# EAGLE schematic L4V2-5 (EAGLE 8.7.0)

## Sheet 1 of 3: MCUs
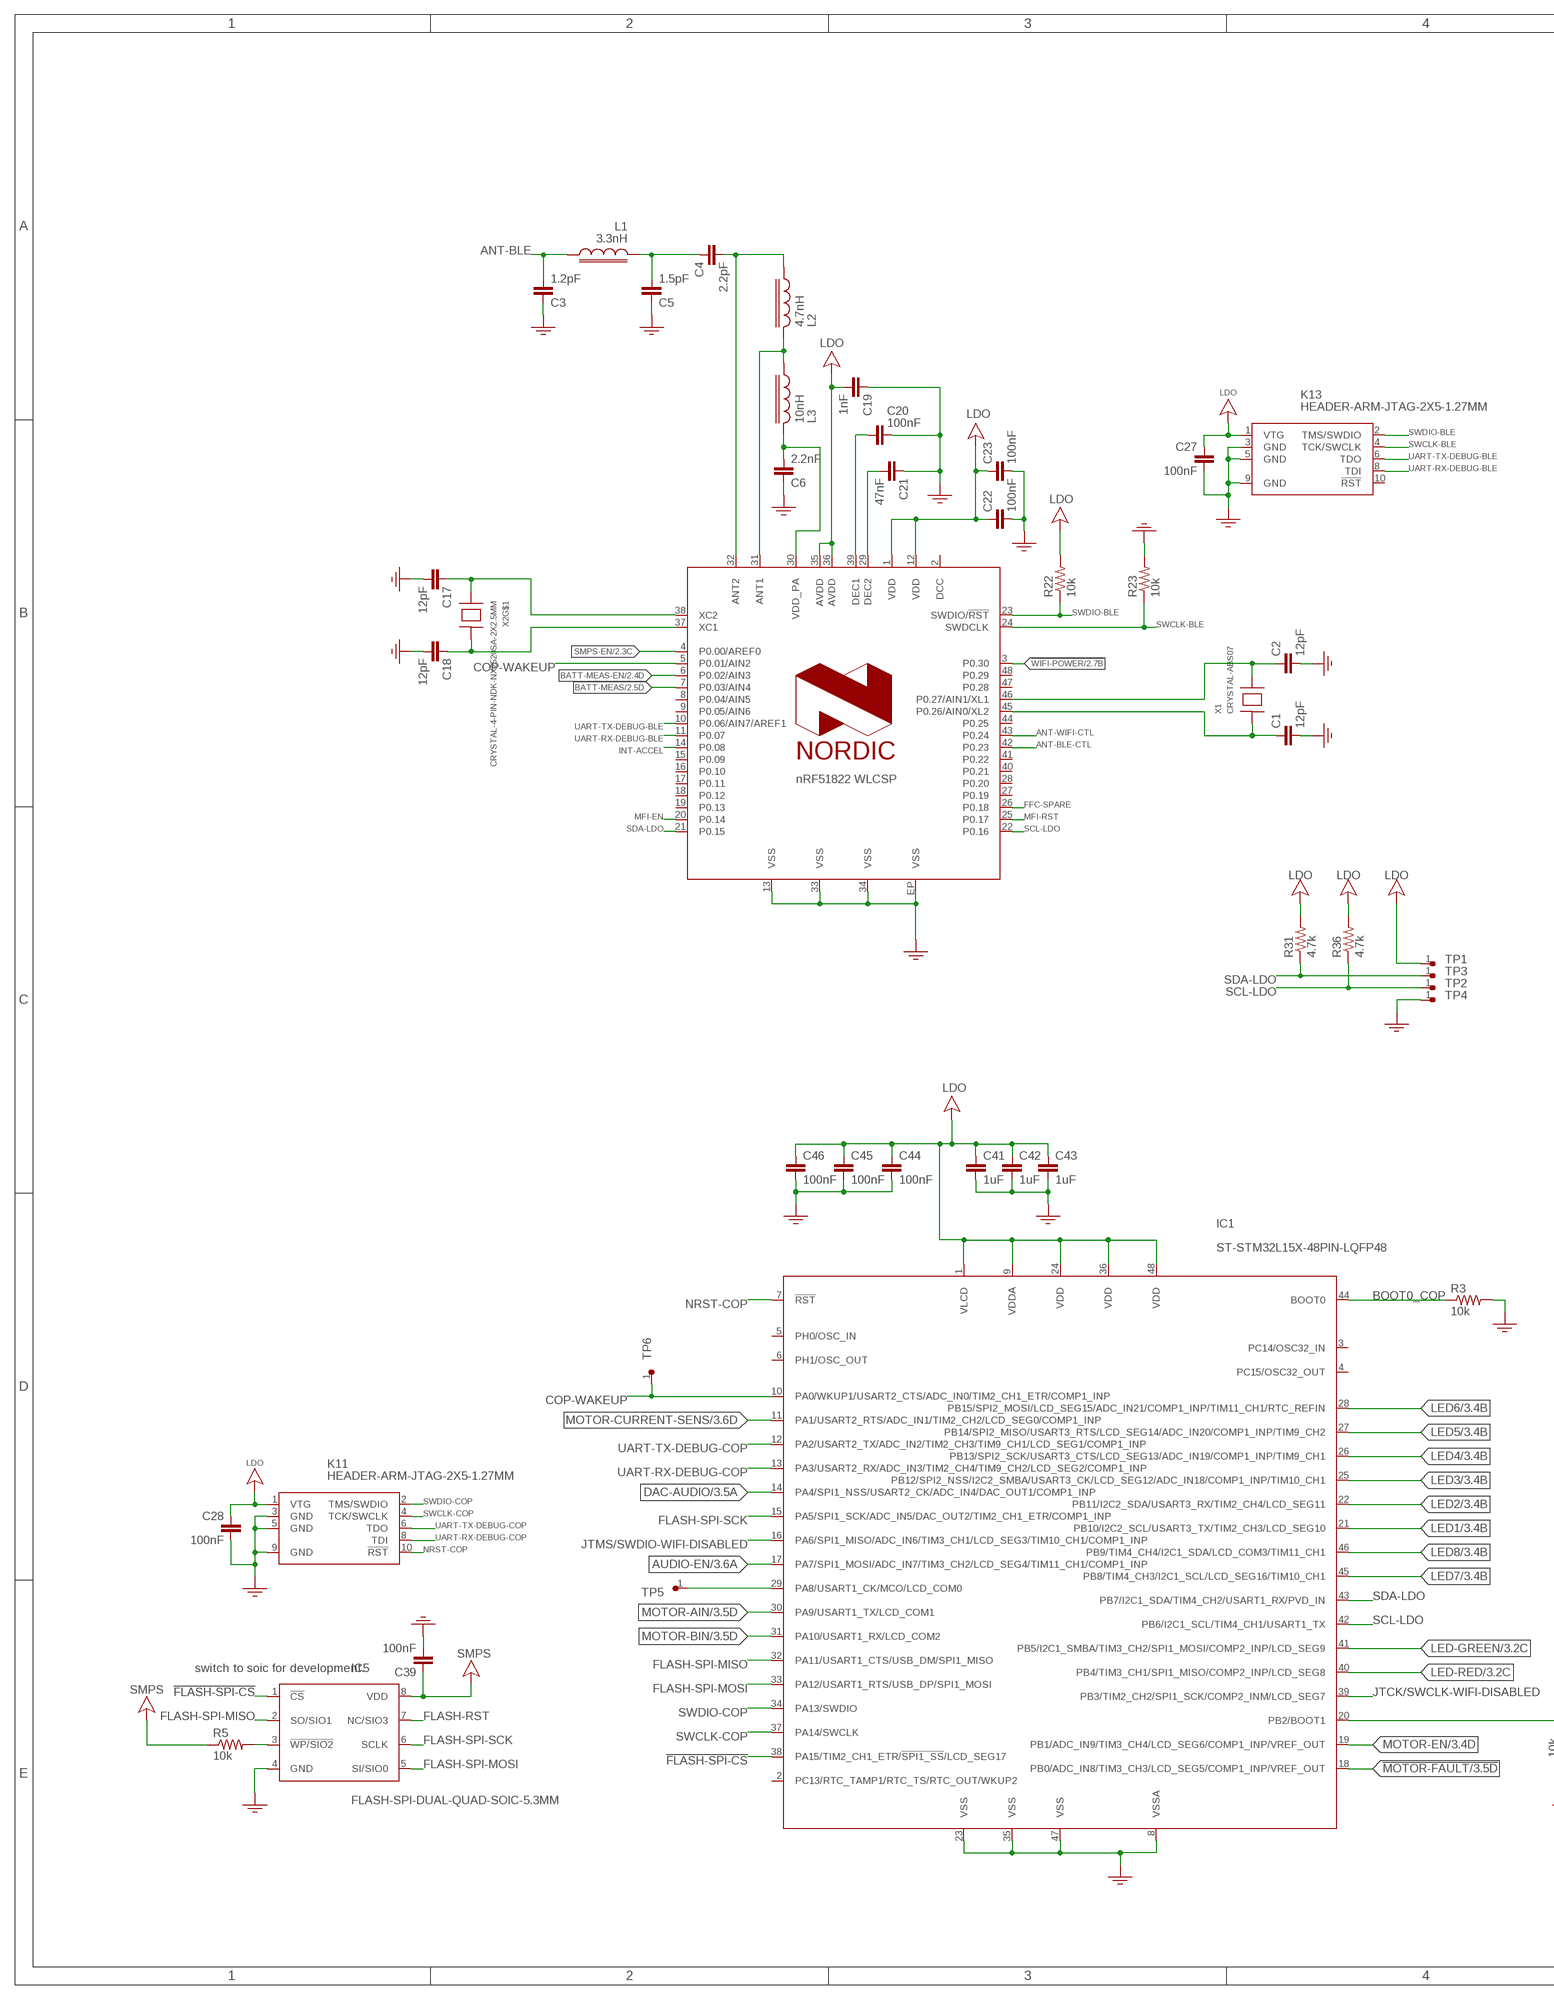
[diagram p0: schematic, sheet 1, part 1 of 2]
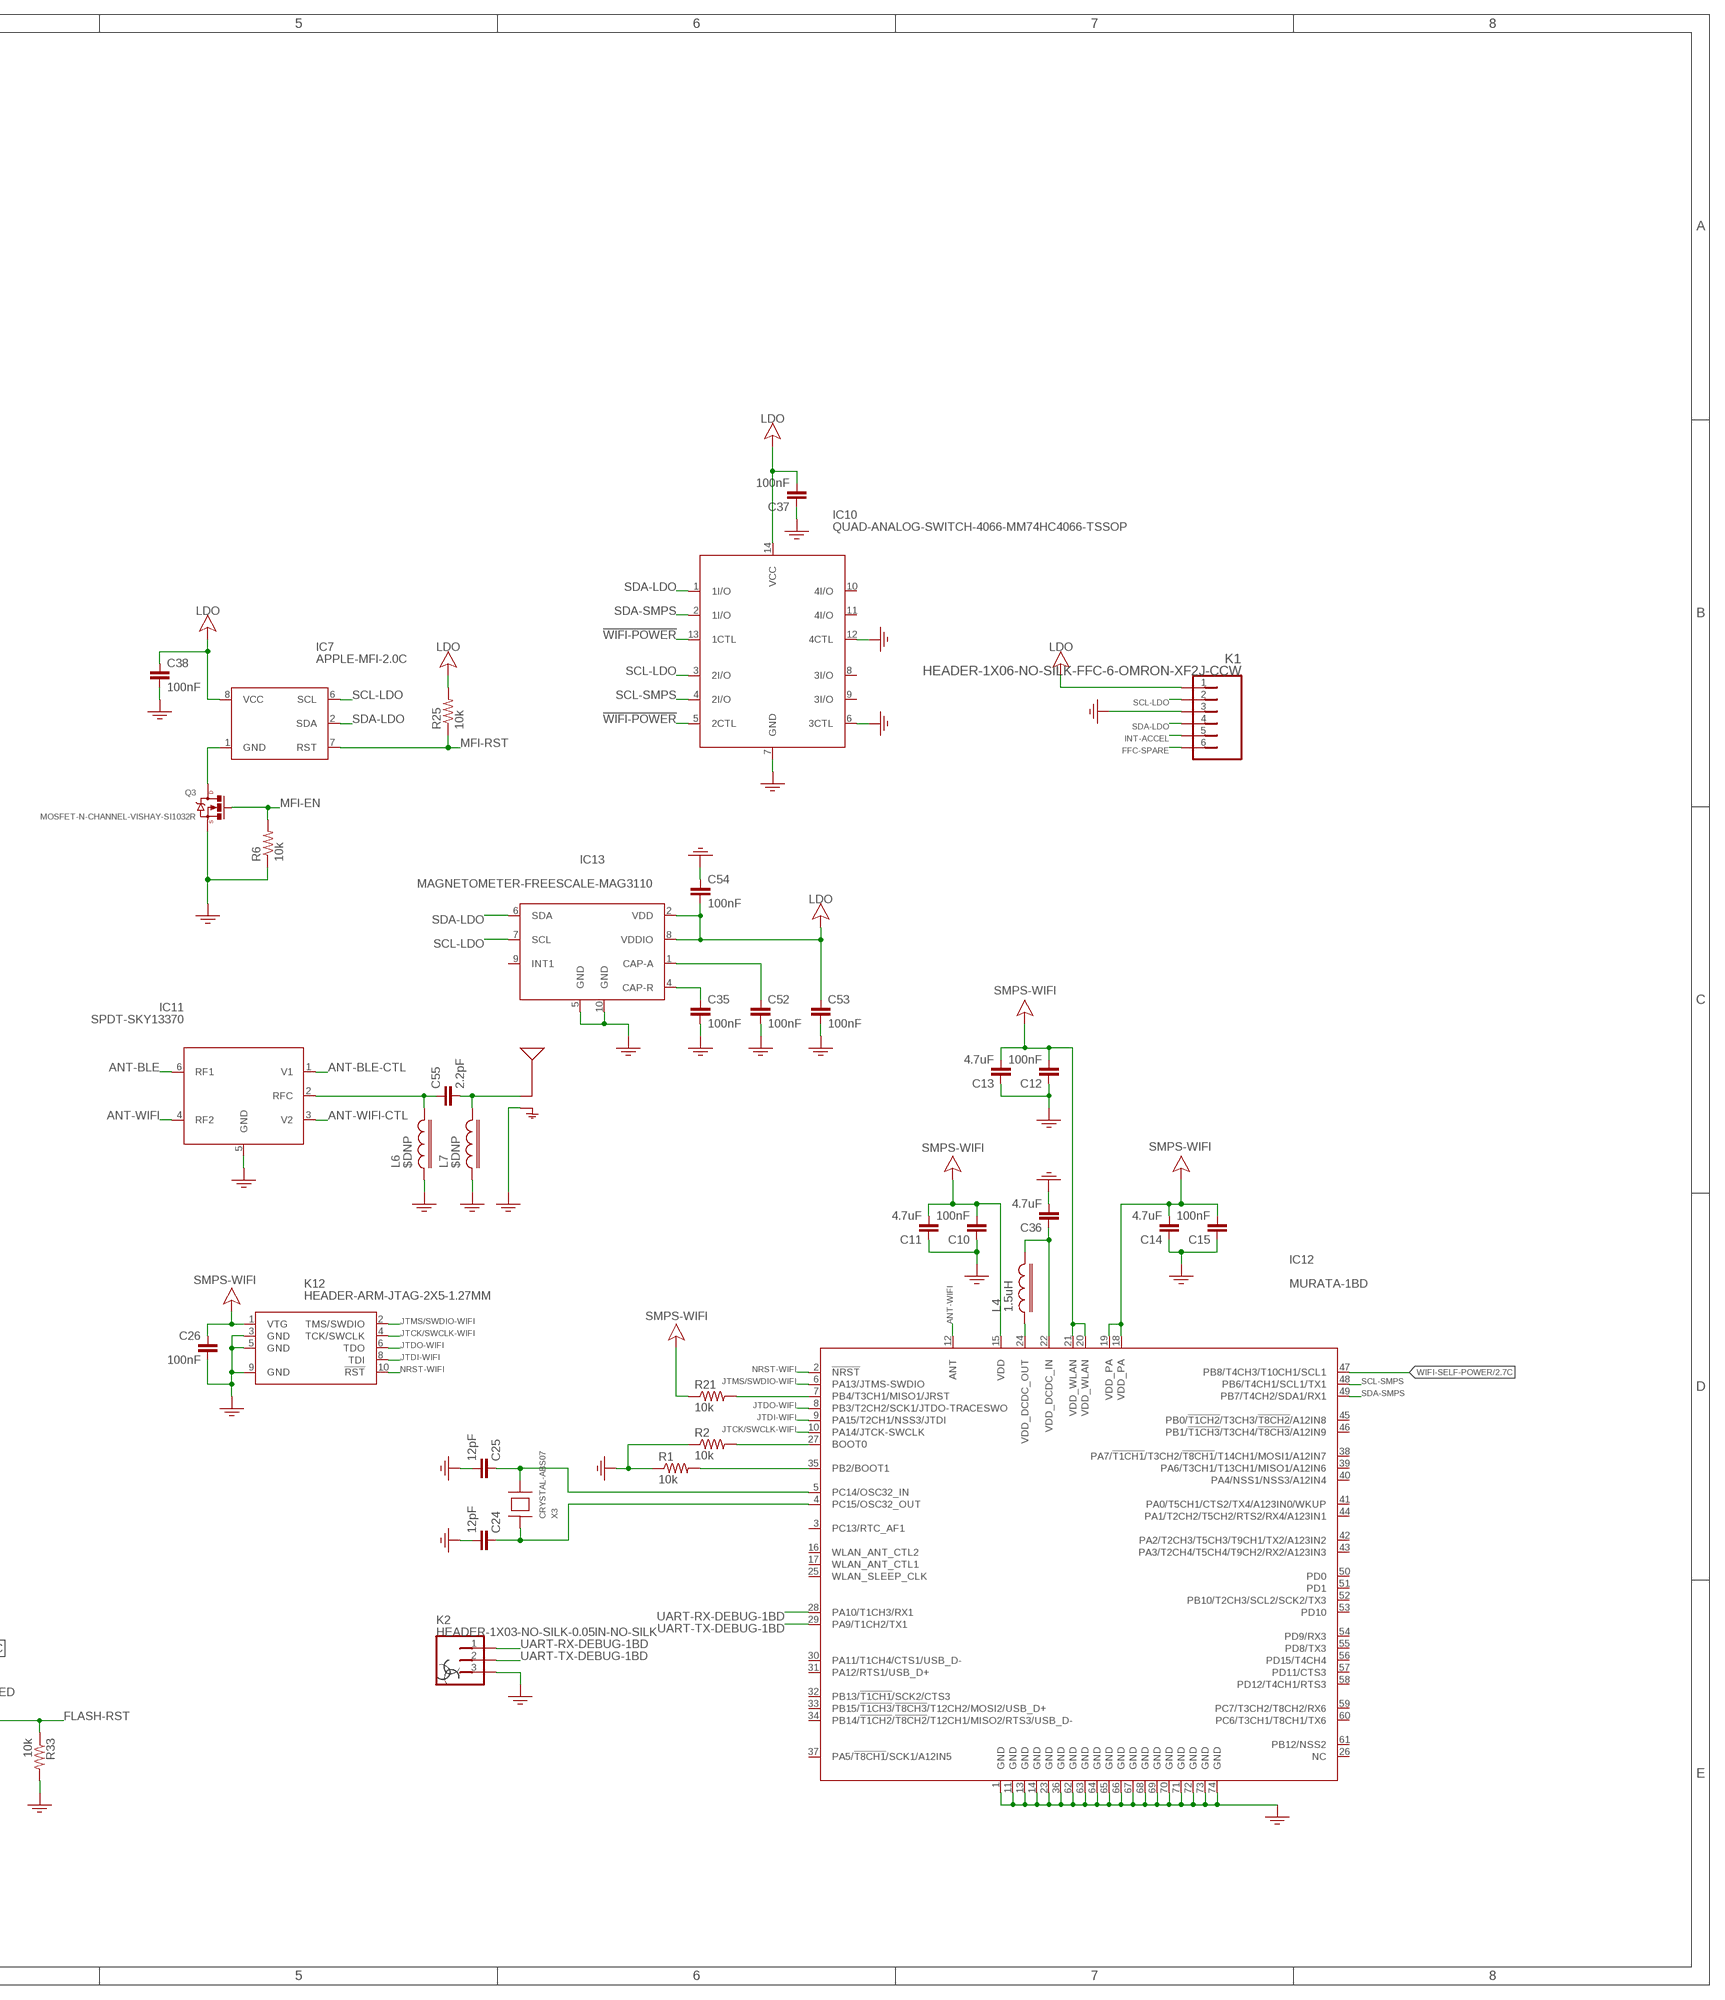
[diagram p1: schematic, sheet 1, part 2 of 2]

### Parts
ANT1  ANTENNA-WITH-GND-2.450GHZ-TI-AN043  [ANTENNA-2.450GHZ-TI-AN043]
C1  12pF  CAP-0402  [0402]
C2  12pF  CAP-0402  [0402]
C3  1.2pF  CAP-0402  [0402]
C4  2.2pF  CAP-0402  [0402]
C5  1.5pF  CAP-0402  [0402]
C6  2.2nF  CAP-0402  [0402]
C10  100nF  CAP-0402  [0402]
C11  4.7uF  CAP-0402  [0402]
C12  100nF  CAP-0402  [0402]
C13  4.7uF  CAP-0402  [0402]
C14  4.7uF  CAP-0402  [0402]
C15  100nF  CAP-0402  [0402]
C17  12pF  CAP-0402  [0402]
C18  12pF  CAP-0402  [0402]
C19  1nF  CAP-0402  [0402]
C20  100nF  CAP-0402  [0402]
C21  47nF  CAP-0402  [0402]
C22  100nF  CAP-0402  [0402]
C23  100nF  CAP-0402  [0402]
C24  12pF  CAP-0402  [0402]
C25  12pF  CAP-0402  [0402]
C26  100nF  CAP-0402  [0402]
C27  100nF  CAP-0402  [0402]
C28  100nF  CAP-0402  [0402]
C35  100nF  CAP-0402  [0402]
C36  4.7uF  CAP-0402  [0402]
C37  100nF  CAP-0402  [0402]
C38  100nF  CAP-0402  [0402]
C39  100nF  CAP-0402  [0402]
C41  1uF  CAP-0402  [0402]
C42  1uF  CAP-0402  [0402]
C43  1uF  CAP-0402  [0402]
C44  100nF  CAP-0402  [0402]
C45  100nF  CAP-0402  [0402]
C46  100nF  CAP-0402  [0402]
C52  100nF  CAP-0402  [0402]
C53  100nF  CAP-0402  [0402]
C54  100nF  CAP-0402  [0402]
C55  2.2pF  CAP-0402-MIN  [0402-MIN]
IC1  ST-STM32L15X-48PIN-LQFP48  [LQFP48-0.5MM]
IC3  BLUETOOTH-4.0-SOC-NORDIC-NRF51822-QFN48  [QFN48-5X5MM-0.4MM]
IC5  FLASH-SPI-DUAL-QUAD-SOIC-5.3MM  [SOIC8-5.3MM-MINIMAL]
IC7  APPLE-MFI-2.0C  [DFN8-2.5MMX2.5MM]
IC10  QUAD-ANALOG-SWITCH-4066-MM74HC4066-TSSOP  [TSSOP14]
IC11  SPDT-SKY13370  [DFN6-1.5MMX1.5MM]
IC12  MURATA-1BD  [MURATA-1BD]
IC13  MAGNETOMETER-FREESCALE-MAG3110  [QFN10-2X2MM-FREESCALE-MAG3110]
K1  HEADER-1X06-NO-SILK-FFC-6-OMRON-XF2J-CCW  [HEADER-FFC-6-OMRON-XF2J-CCW]
K2  HEADER-1X03-NO-SILK-0.05IN-NO-SILK  [HEADER-1X03-0.05IN-NO-SILK]
K11  HEADER-ARM-JTAG-2X5-1.27MM  [HEADER-SMT-1.27MM-5X2-JTAG]
K12  HEADER-ARM-JTAG-2X5-1.27MM  [HEADER-SMT-1.27MM-5X2-JTAG]
K13  HEADER-ARM-JTAG-2X5-1.27MM  [HEADER-SMT-1.27MM-5X2-JTAG]
L1  3.3nH  INDUCTOR-0402  [0402]
L2  4.7nH  INDUCTOR-0402  [0402]
L3  10nH  INDUCTOR-0402  [0402]
L4  1.5uH  INDUCTOR-0805-WIDE  [0805-WIDE]
L6  $DNP  INDUCTOR-0402-MIN  [0402-MIN]
L7  $DNP  INDUCTOR-0402-MIN  [0402-MIN]
Q3  MOSFET-N-CHANNEL-VISHAY-SI1032R  [SC-75A]
R1  10k  RESISTOR-0402  [0402]
R2  10k  RESISTOR-0402  [0402]
R3  10k  RESISTOR-0402  [0402]
R5  10k  RESISTOR-0402  [0402]
R6  10k  RESISTOR-0402  [0402]
R21  10k  RESISTOR-0402  [0402]
R22  10k  RESISTOR-0402  [0402]
R23  10k  RESISTOR-0402  [0402]
R25  10k  RESISTOR-0402  [0402]
R31  4.7k  RESISTOR-0402  [0402]
R33  10k  RESISTOR-0402  [0402]
R36  4.7k  RESISTOR-0402  [0402]
TP1  $DNP  TEST-POINT-0.75MM  [TEST-POINT-0.75MM]
TP2  $DNP  TEST-POINT-0.75MM  [TEST-POINT-0.75MM]
TP3  $DNP  TEST-POINT-0.75MM  [TEST-POINT-0.75MM]
TP4  $DNP  TEST-POINT-0.75MM  [TEST-POINT-0.75MM]
TP5  $DNP  TEST-POINT-0.75MM  [TEST-POINT-0.75MM]
TP6  $DNP  TEST-POINT-0.75MM  [TEST-POINT-0.75MM]
X1  CRYSTAL-ABS07  CRYSTAL-1206  [1206-MIN]
X2  CRYSTAL-4-PIN-NDK-NX2520SA-2X2.5MM  [CRYSTAL-NDK-NX2025SA-2X2.5MM]
X3  CRYSTAL-ABS07  CRYSTAL-1206  [1206-MIN]

### Nets
16MHZ-XTAL-IN: C18.2 IC3.37(XC1) X2.1
16MHZ-XTAL-OUT: C17.2 IC3.38(XC2) X2.3
32KHZ-XTAL-IN-BLE: C2.2 IC3.46(P0.27/AIN1/XL1) X1.2
32KHZ-XTAL-IN-WIFI: C25.2 IC12.5(PC14/OSC32_IN) X3.2
32KHZ-XTAL-OUT-BLE: C1.2 IC3.45(P0.26/AIN0/XL2) X1.1
32KHZ-XTAL-OUT-WIFI: C24.2 IC12.4(PC15/OSC32_OUT) X3.1
!FLASH-SPI-CS: IC1.38(PA15/TIM2_CH1_ETR/!SPI1_SS!/LCD_SEG17) IC5.1(!CS)
!MOTOR-FAULT: IC1.18(PB0/ADC_IN8/TIM3_CH3/LCD_SEG5/COMP1_INP/VREF_OUT) ; also sheet 3
!WIFI-POWER: IC3.3(P0.30) IC10.5(2CTL) IC10.13(1CTL) ; also sheet 2
ANT-BLE: C3.1 IC11.6(RF1) L1.2
ANT-BLE-CTL: IC3.42(P0.23) IC11.1(V1)
ANT-WIFI: IC11.4(RF2) IC12.12(ANT)
ANT-WIFI-CTL: IC3.43(P0.24) IC11.3(V2)
AUDIO-EN: IC1.17(PA7/SPI1_MOSI/ADC_IN7/TIM3_CH2/LCD_SEG4/TIM11_CH1/COMP1_INP) ; also sheet 3
BATT-MEAS: IC3.7(P0.03/AIN4) ; also sheet 2
BATT-MEAS-EN: IC3.6(P0.02/AIN3) ; also sheet 2
BOOT0_COP: IC1.44(BOOT0) R3.1
COP-WAKEUP: IC1.10(PA0/WKUP1/USART2_CTS/ADC_IN0/TIM2_CH1_ETR/COMP1_INP) IC3.5(P0.01/AIN2) TP6.1
DAC-AUDIO: IC1.14(PA4/SPI1_NSS/USART2_CK/ADC_IN4/DAC_OUT1/COMP1_INP) ; also sheet 3
FFC-SPARE: IC3.26(P0.18) K1.6
FLASH-RST: IC1.20(PB2/BOOT1) IC5.7(NC/SIO3) R33.1
FLASH-SPI-MISO: IC1.32(PA11/USART1_CTS/USB_DM/SPI1_MISO) IC5.2(SO/SIO1)
FLASH-SPI-MOSI: IC1.33(PA12/USART1_RTS/USB_DP/SPI1_MOSI) IC5.5(SI/SIO0)
FLASH-SPI-SCK: IC1.15(PA5/SPI1_SCK/ADC_IN5/DAC_OUT2/TIM2_CH1_ETR/COMP1_INP) IC5.6(SCLK)
GND: ANT1.RFGND(GND) C1.1 C2.1 C3.2 C5.2 C6.2 C10.2 C11.2 C12.2 C13.2 C14.2 C15.2 C17.1 C18.1 C19.2 C20.2 C21.2 C22.1 C23.1 C24.1 C25.1 C26.1 C27.1 C28.1 C35.1 C36.1 C37.2 C38.1 C39.1 C41.1 C42.1 C43.1 C44.1 C45.1 C46.1 C52.1 C53.1 C54.2 IC1.8(VSSA) IC1.23(VSS) IC1.35(VSS) IC1.47(VSS) IC3.13(VSS) IC3.33(VSS) IC3.34(VSS) IC3.EP(VSS) IC5.4(GND) IC10.6(3CTL) IC10.7(GND) IC10.12(4CTL) IC11.5(GND) IC12.1(GND) IC12.11(GND) IC12.13(GND) IC12.14(GND) IC12.23(GND) IC12.36(GND) IC12.62(GND) IC12.63(GND) IC12.64(GND) IC12.65(GND) IC12.66(GND) IC12.67(GND) IC12.68(GND) IC12.69(GND) IC12.70(GND) IC12.71(GND) IC12.72(GND) IC12.73(GND) IC12.74(GND) IC13.5(GND) IC13.10(GND) K1.3 K2.3 K11.3(GND) K11.5(GND) K11.9(GND) K12.3(GND) K12.5(GND) K12.9(GND) K13.3(GND) K13.5(GND) K13.9(GND) L6.1 L7.1 Q3.2(SOURCE) R1.1 R2.1 R3.2 R6.1 R23.2 R33.2 TP4.1 ; also sheet 2,3
INT-ACCEL: IC3.14(P0.08) K1.5
JRST-WIFI: IC12.7(PB4/T3CH1/MISO1/JRST) R21.2
JTCK/SWCLK-WIFI: IC12.10(PA14/JTCK-SWCLK) K12.4(TCK/SWCLK)
JTCK/SWCLK-WIFI-DISABLED: IC1.39(PB3/TIM2_CH2/SPI1_SCK/COMP2_INM/LCD_SEG7)
JTDI-WIFI: IC12.9(PA15/T2CH1/NSS3/JTDI) K12.8(TDI)
JTDO-WIFI: IC12.8(PB3/T2CH2/SCK1/JTDO-TRACESWO) K12.6(TDO)
JTMS/SWDIO-WIFI: IC12.6(PA13/JTMS-SWDIO) K12.2(TMS/SWDIO)
JTMS/SWDIO-WIFI-DISABLED: IC1.16(PA6/SPI1_MISO/ADC_IN6/TIM3_CH1/LCD_SEG3/TIM10_CH1/COMP1_INP)
LDO: C19.1 C22.2 C23.2 C27.2 C28.2 C37.1 C38.2 C41.2 C42.2 C43.2 C44.2 C45.2 C46.2 C53.2 C54.1 IC1.1(VLCD) IC1.9(VDDA) IC1.24(VDD) IC1.36(VDD) IC1.48(VDD) IC3.1(VDD) IC3.12(VDD) IC3.35(AVDD) IC3.36(AVDD) IC7.8(VCC) IC10.14(VCC) IC13.2(VDD) IC13.8(VDDIO) K1.1 K11.1(VTG) K13.1(VTG) R22.2 R25.2 R31.2 R36.2 TP1.1 ; supply symbol labelled V ; also sheet 2
LED1: IC1.21(PB10/I2C2_SCL/USART3_TX/TIM2_CH3/LCD_SEG10) ; also sheet 3
LED2: IC1.22(PB11/I2C2_SDA/USART3_RX/TIM2_CH4/LCD_SEG11) ; also sheet 3
LED3: IC1.25(PB12/SPI2_NSS/I2C2_SMBA/USART3_CK/LCD_SEG12/ADC_IN18/COMP1_INP/TIM10_CH1) ; also sheet 3
LED4: IC1.26(PB13/SPI2_SCK/USART3_CTS/LCD_SEG13/ADC_IN19/COMP1_INP/TIM9_CH1) ; also sheet 3
LED5: IC1.27(PB14/SPI2_MISO/USART3_RTS/LCD_SEG14/ADC_IN20/COMP1_INP/TIM9_CH2) ; also sheet 3
LED6: IC1.28(PB15/SPI2_MOSI/LCD_SEG15/ADC_IN21/COMP1_INP/TIM11_CH1/RTC_REFIN) ; also sheet 3
LED7: IC1.45(PB8/TIM4_CH3/I2C1_SCL/LCD_SEG16/TIM10_CH1) ; also sheet 3
LED8: IC1.46(PB9/TIM4_CH4/I2C1_SDA/LCD_COM3/TIM11_CH1) ; also sheet 3
LED-GREEN: IC1.41(PB5/I2C1_SMBA/TIM3_CH2/SPI1_MOSI/COMP2_INP/LCD_SEG9) ; also sheet 3
LED-RED: IC1.40(PB4/TIM3_CH1/SPI1_MISO/COMP2_INP/LCD_SEG8) ; also sheet 3
MFI-EN: IC3.20(P0.14) Q3.1(GATE) R6.2
MFI-RST: IC3.25(P0.17) IC7.7(RST) R25.1
MOTOR-AIN: IC1.30(PA9/USART1_TX/LCD_COM1) ; also sheet 3
MOTOR-BIN: IC1.31(PA10/USART1_RX/LCD_COM2) ; also sheet 3
MOTOR-CURRENT-SENS: IC1.11(PA1/USART2_RTS/ADC_IN1/TIM2_CH2/LCD_SEG0/COMP1_INP) ; also sheet 3
MOTOR-EN: IC1.19(PB1/ADC_IN9/TIM3_CH4/LCD_SEG6/COMP1_INP/VREF_OUT) ; also sheet 3
N$1: C20.1 IC3.39(DEC1)
N$2: IC3.31(ANT1) L2.1 L3.2
N$3: C55.2 IC11.2(RFC) L6.2
N$4: C4.1 IC3.32(ANT2) L2.2
N$5: C4.2 C5.1 L1.1
N$8: IC12.27(BOOT0) R2.2
N$9: IC12.24(VDD_DCDC_OUT) L4.1
N$11: C21.1 IC3.29(DEC2)
N$14: IC12.35(PB2/BOOT1) R1.2
N$19: IC5.3(!WP/SIO2) R5.2
N$20: ANT1.ANT(RF) C55.1 L7.2
N$21: IC7.1(GND) Q3.3(DRAIN)
N$24: IC1.29(PA8/USART1_CK/MCO/LCD_COM0) TP5.1
N$44: C6.1 IC3.30(VDD_PA) L3.1
N$50: C36.2 IC12.22(VDD_DCDC_IN) L4.2
N$51: C35.2 IC13.4(CAP-R)
N$52: C52.2 IC13.1(CAP-A)
NRST-COP: IC1.7(!RST) K11.10(!RST)
NRST-WIFI: IC12.2(!NRST) K12.10(!RST)
SCL-LDO: IC1.42(PB6/I2C1_SCL/TIM4_CH1/USART1_TX) IC3.22(P0.16) IC7.6(SCL) IC10.3(2I/O) IC13.7(SCL) K1.2 R36.1 TP2.1
SCL-SMPS: IC10.4(2I/O) IC12.48(PB6/T4CH1/SCL1/TX1)
SDA-LDO: IC1.43(PB7/I2C1_SDA/TIM4_CH2/USART1_RX/PVD_IN) IC3.21(P0.15) IC7.2(SDA) IC10.1(1I/O) IC13.6(SDA) K1.4 R31.1 TP3.1
SDA-SMPS: IC10.2(1I/O) IC12.49(PB7/T4CH2/SDA1/RX1)
SMPS: C39.2 IC5.8(VDD) R5.1 ; supply symbol labelled V ; also sheet 2,3
SMPS-EN: IC3.4(P0.00/AREF0) ; also sheet 2
SMPS-WIFI: C10.1 C11.1 C12.1 C13.1 C14.1 C15.1 C26.2 IC12.15(VDD) IC12.18(VDD_PA) IC12.19(VDD_PA) IC12.20(VDD_WLAN) IC12.21(VDD_WLAN) K12.1(VTG) R21.1 ; supply symbol labelled V ; also sheet 2
SWCLK-BLE: IC3.24(SWDCLK) K13.4(TCK/SWCLK) R23.1
SWCLK-COP: IC1.37(PA14/SWCLK) K11.4(TCK/SWCLK)
SWDIO-BLE: IC3.23(SWDIO/!RST) K13.2(TMS/SWDIO) R22.1
SWDIO-COP: IC1.34(PA13/SWDIO) K11.2(TMS/SWDIO)
UART-RX-DEBUG-1BD: IC12.28(PA10/T1CH3/RX1) K2.1
UART-RX-DEBUG-BLE: IC3.11(P0.07) K13.8(TDI)
UART-RX-DEBUG-COP: IC1.13(PA3/USART2_RX/ADC_IN3/TIM2_CH4/TIM9_CH2/LCD_SEG2/COMP1_INP) K11.8(TDI)
UART-TX-DEBUG-1BD: IC12.29(PA9/T1CH2/TX1) K2.2
UART-TX-DEBUG-BLE: IC3.10(P0.06/AIN7/AREF1) K13.6(TDO)
UART-TX-DEBUG-COP: IC1.12(PA2/USART2_TX/ADC_IN2/TIM2_CH3/TIM9_CH1/LCD_SEG1/COMP1_INP) K11.6(TDO)
WIFI-SELF-POWER: IC12.47(PB8/T4CH3/T10CH1/SCL1) ; also sheet 2
Unconnected: IC1.2(PC13/RTC_TAMP1/RTC_TS/RTC_OUT/WKUP2) IC1.3(PC14/OSC32_IN) IC1.4(PC15/OSC32_OUT) IC1.5(PH0/OSC_IN) IC1.6(PH1/OSC_OUT) IC3.2(DCC) IC3.8(P0.04/AIN5) IC3.9(P0.05/AIN6) IC3.15(P0.09) IC3.16(P0.10) IC3.17(P0.11) IC3.18(P0.12) IC3.19(P0.13) IC3.27(P0.19) IC3.28(P0.20) IC3.40(P0.21) IC3.41(P0.22) IC3.44(P0.25) IC3.47(P0.28) IC3.48(P0.29) IC10.8(3I/O) IC10.9(3I/O) IC10.10(4I/O) IC10.11(4I/O) IC12.3(PC13/RTC_AF1) IC12.16(WLAN_ANT_CTL2) IC12.17(WLAN_ANT_CTL1) IC12.25(WLAN_SLEEP_CLK) IC12.26(NC) IC12.30(PA11/T1CH4/CTS1/USB_D-) IC12.31(PA12/RTS1/USB_D+) IC12.32(PB13/!T1CH1!/SCK2/CTS3) IC12.33(PB15/!T1CH3!/!T8CH3!/T12CH2/MOSI2/USB_D+) IC12.34(PB14/!T1CH2!/!T8CH2!/T12CH1/MISO2/RTS3/USB_D-) IC12.37(PA5/!T8CH1!/SCK1/A12IN5) IC12.38(PA7/!T1CH1!/T3CH2/!T8CH1!/T14CH1/MOSI1/A12IN7) IC12.39(PA6/T3CH1/T13CH1/MISO1/A12IN6) IC12.40(PA4/NSS1/NSS3/A12IN4) IC12.41(PA0/T5CH1/CTS2/TX4/A123IN0/WKUP) IC12.42(PA2/T2CH3/T5CH3/T9CH1/TX2/A123IN2) IC12.43(PA3/T2CH4/T5CH4/T9CH2/RX2/A123IN3) IC12.44(PA1/T2CH2/T5CH2/RTS2/RX4/A123IN1) IC12.45(PB0/!T1CH2!/T3CH3/!T8CH2!/A12IN8) IC12.46(PB1/!T1CH3!/T3CH4/!T8CH3!/A12IN9) IC12.50(PD0) IC12.51(PD1) IC12.52(PB10/T2CH3/SCL2/SCK2/TX3) IC12.53(PD10) IC12.54(PD9/RX3) IC12.55(PD8/TX3) IC12.56(PD15/T4CH4) IC12.57(PD11/CTS3) IC12.58(PD12/T4CH1/RTS3) IC12.59(PC7/T3CH2/T8CH2/RX6) IC12.60(PC6/T3CH1/T8CH1/TX6) IC12.61(PB12/NSS2) IC13.9(INT1) K13.10(!RST) X2.2 X2.4

### Notes on the sheet
- switch to soic for development.

## Sheet 2 of 3: Power
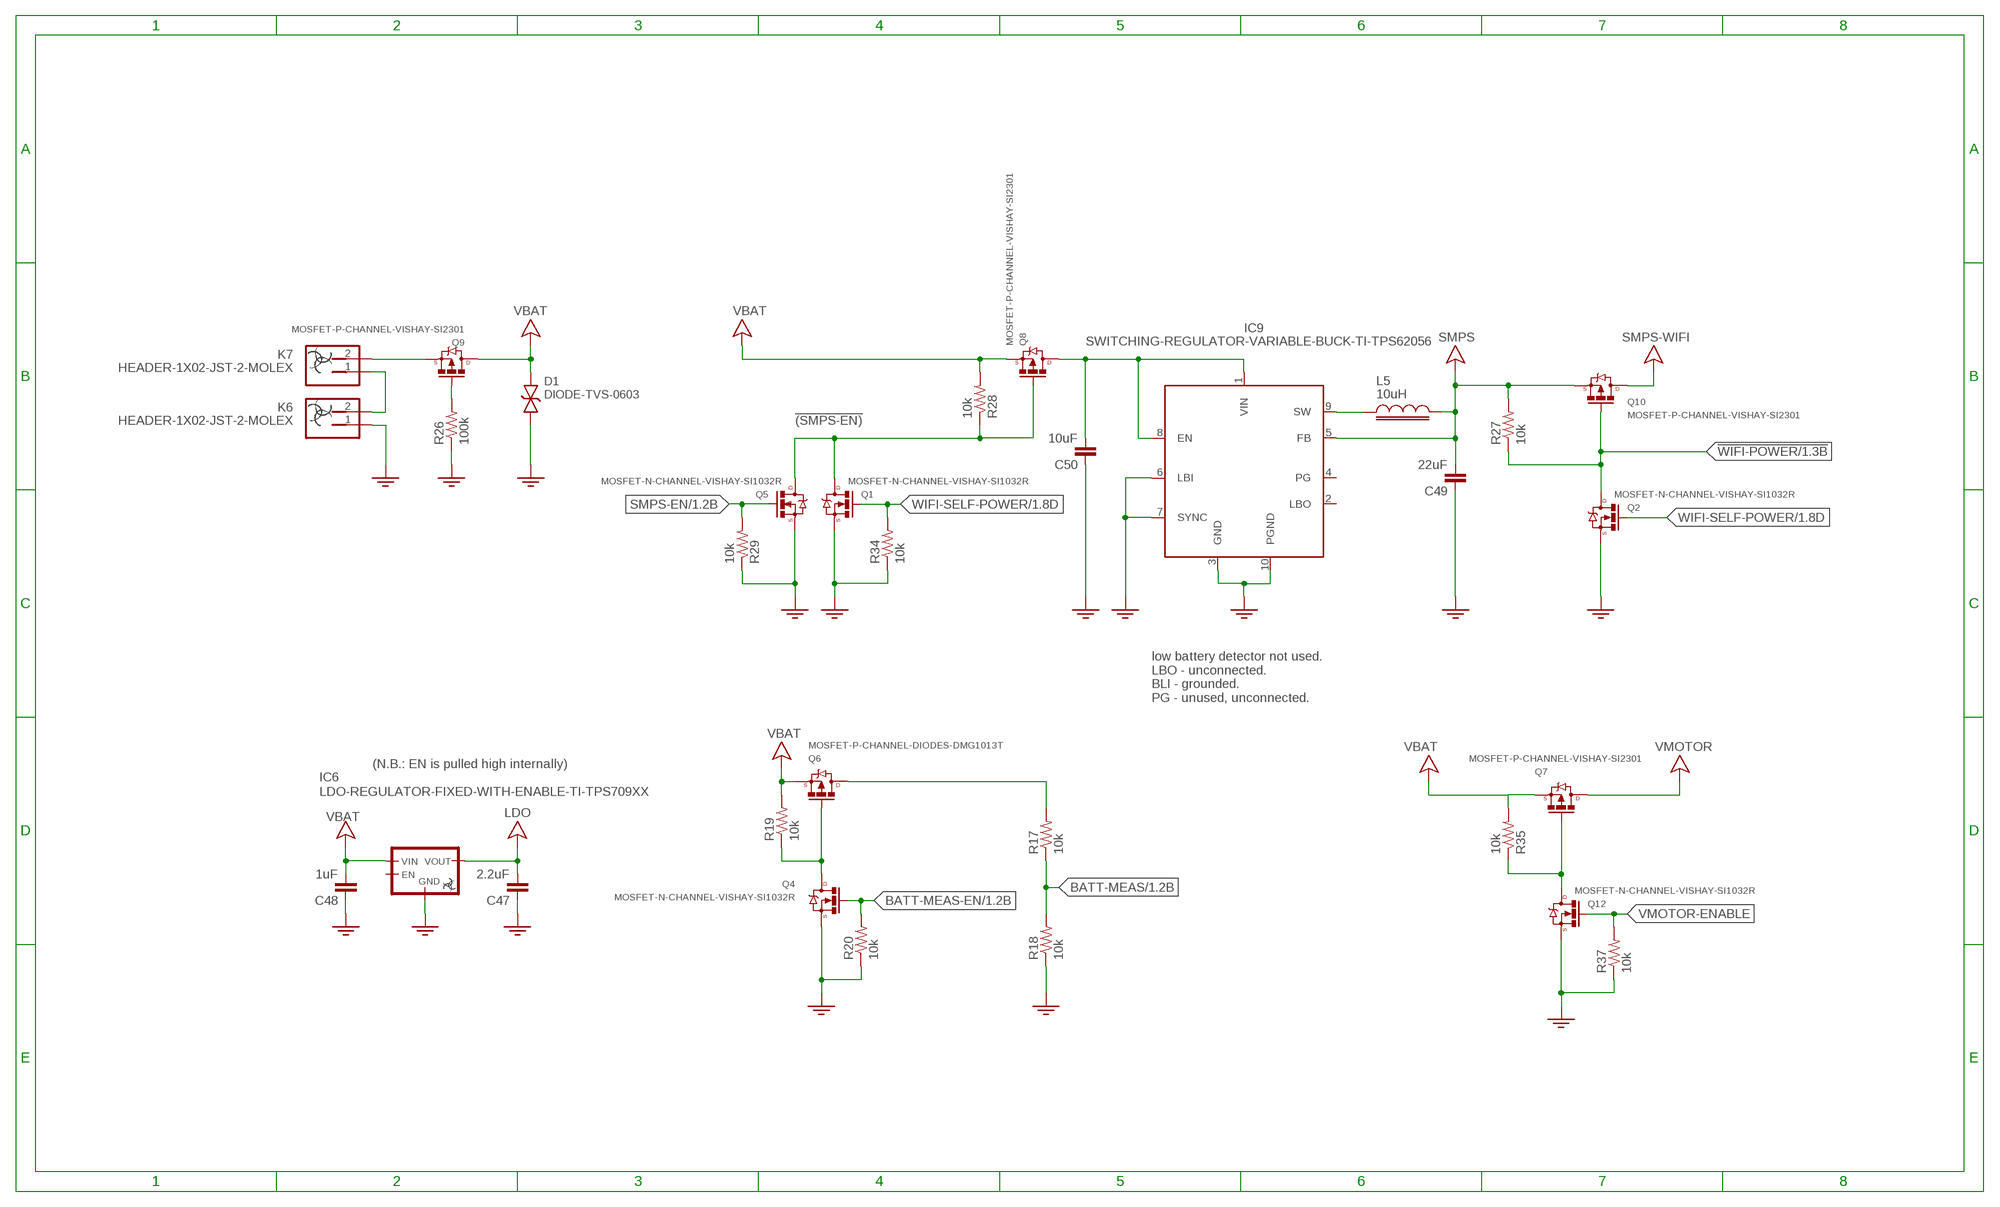
[diagram p2: schematic, sheet 2]

### Parts
C47  2.2uF  CAP-0402  [0402]
C48  1uF  CAP-0402  [0402]
C49  22uF  CAP-0805-MIN  [0805-MIN]
C50  10uF  CAP-0805-MIN  [0805-MIN]
D1  DIODE-TVS-0603  [0603]
IC6  LDO-REGULATOR-FIXED-WITH-ENABLE-TI-TPS709XX  [SOT23-5]
IC9  SWITCHING-REGULATOR-VARIABLE-BUCK-TI-TPS62056  [VSSOP10]
K6  HEADER-1X02-JST-2-MOLEX  [HEADER-JST-2-MOLEX-53261-0271]
K7  HEADER-1X02-JST-2-MOLEX  [HEADER-JST-2-MOLEX-53261-0271]
L5  10uH  INDUCTOR-1210-MIN  [1210-INDUCTOR-MIN]
Q1  MOSFET-N-CHANNEL-VISHAY-SI1032R  [SC-75A]
Q2  MOSFET-N-CHANNEL-VISHAY-SI1032R  [SC-75A]
Q4  MOSFET-N-CHANNEL-VISHAY-SI1032R  [SC-75A]
Q5  MOSFET-N-CHANNEL-VISHAY-SI1032R  [SC-75A]
Q6  MOSFET-P-CHANNEL-DIODES-DMG1013T  [SC-75A]
Q7  MOSFET-P-CHANNEL-VISHAY-SI2301  [SOT23-3]
Q8  MOSFET-P-CHANNEL-VISHAY-SI2301  [SOT23-3]
Q9  MOSFET-P-CHANNEL-VISHAY-SI2301  [SOT23-3]
Q10  MOSFET-P-CHANNEL-VISHAY-SI2301  [SOT23-3]
Q12  MOSFET-N-CHANNEL-VISHAY-SI1032R  [SC-75A]
R17  10k  RESISTOR-0402  [0402]
R18  10k  RESISTOR-0402  [0402]
R19  10k  RESISTOR-0402  [0402]
R20  10k  RESISTOR-0402  [0402]
R26  100k  RESISTOR-0402  [0402]
R27  10k  RESISTOR-0402  [0402]
R28  10k  RESISTOR-0402  [0402]
R29  10k  RESISTOR-0402  [0402]
R34  10k  RESISTOR-0402  [0402]
R35  10k  RESISTOR-0402  [0402]
R37  10k  RESISTOR-0402  [0402]

### Nets
!(SMPS-EN): Q1.3(DRAIN) Q5.3(DRAIN) Q8.1(GATE) R28.1
!(VMOTOR-EN): Q7.1(GATE) Q12.3(DRAIN) R35.1
!WIFI-POWER: Q2.3(DRAIN) Q10.1(GATE) R27.1 ; also sheet 1
BATT-MEAS: R17.1 R18.2 ; also sheet 1
BATT-MEAS-EN: Q4.1(GATE) R20.2 ; also sheet 1
GND: C47.2 C48.2 C49.2 C50.2 D1.1(A) IC6.2(GND) IC9.3(GND) IC9.6(LBI) IC9.7(SYNC) IC9.10(PGND) K6.1 Q1.2(SOURCE) Q2.2(SOURCE) Q4.2(SOURCE) Q5.2(SOURCE) Q12.2(SOURCE) R18.1 R20.1 R26.1 R29.1 R34.1 R37.1 ; also sheet 1,3
LDO: C47.1 IC6.5(VOUT) ; supply symbol labelled V ; also sheet 1
N$39: Q4.3(DRAIN) Q6.1(GATE) R19.1
N$41: Q6.3(DRAIN) R17.2
N$45: K6.2 K7.1
N$46: Q9.1(GATE) R26.2
N$49: IC9.9(SW) L5.1
SMPS: C49.1 IC9.5(FB) L5.2 Q10.2(SOURCE) R27.2 ; supply symbol labelled V ; also sheet 1,3
SMPS-EN: Q5.1(GATE) R29.2 ; also sheet 1
SMPS-IN: C50.1 IC9.1(VIN) IC9.8(EN) Q8.3(DRAIN)
SMPS-WIFI: Q10.3(DRAIN) ; supply symbol labelled V ; also sheet 1
VBAT: C48.1 D1.2(A) IC6.1(VIN) Q6.2(SOURCE) Q7.2(SOURCE) Q8.2(SOURCE) Q9.3(DRAIN) R19.2 R28.2 R35.2 ; supply symbol labelled V
VBAT-RAW: K7.2 Q9.2(SOURCE)
VMOTOR: Q7.3(DRAIN) ; supply symbol labelled V ; also sheet 3
VMOTOR-ENABLE: Q12.1(GATE) R37.2
WIFI-SELF-POWER: Q1.1(GATE) Q2.1(GATE) R34.2 ; also sheet 1
Unconnected: IC6.3(EN) IC9.2(LBO) IC9.4(PG)

### Notes on the sheet
- low battery detector not used.
  LBO - unconnected.
  BLI - grounded.
  PG - unused, unconnected.
- (N.B.: EN is pulled high internally)

## Sheet 3 of 3: LEDs, Audio, Motor
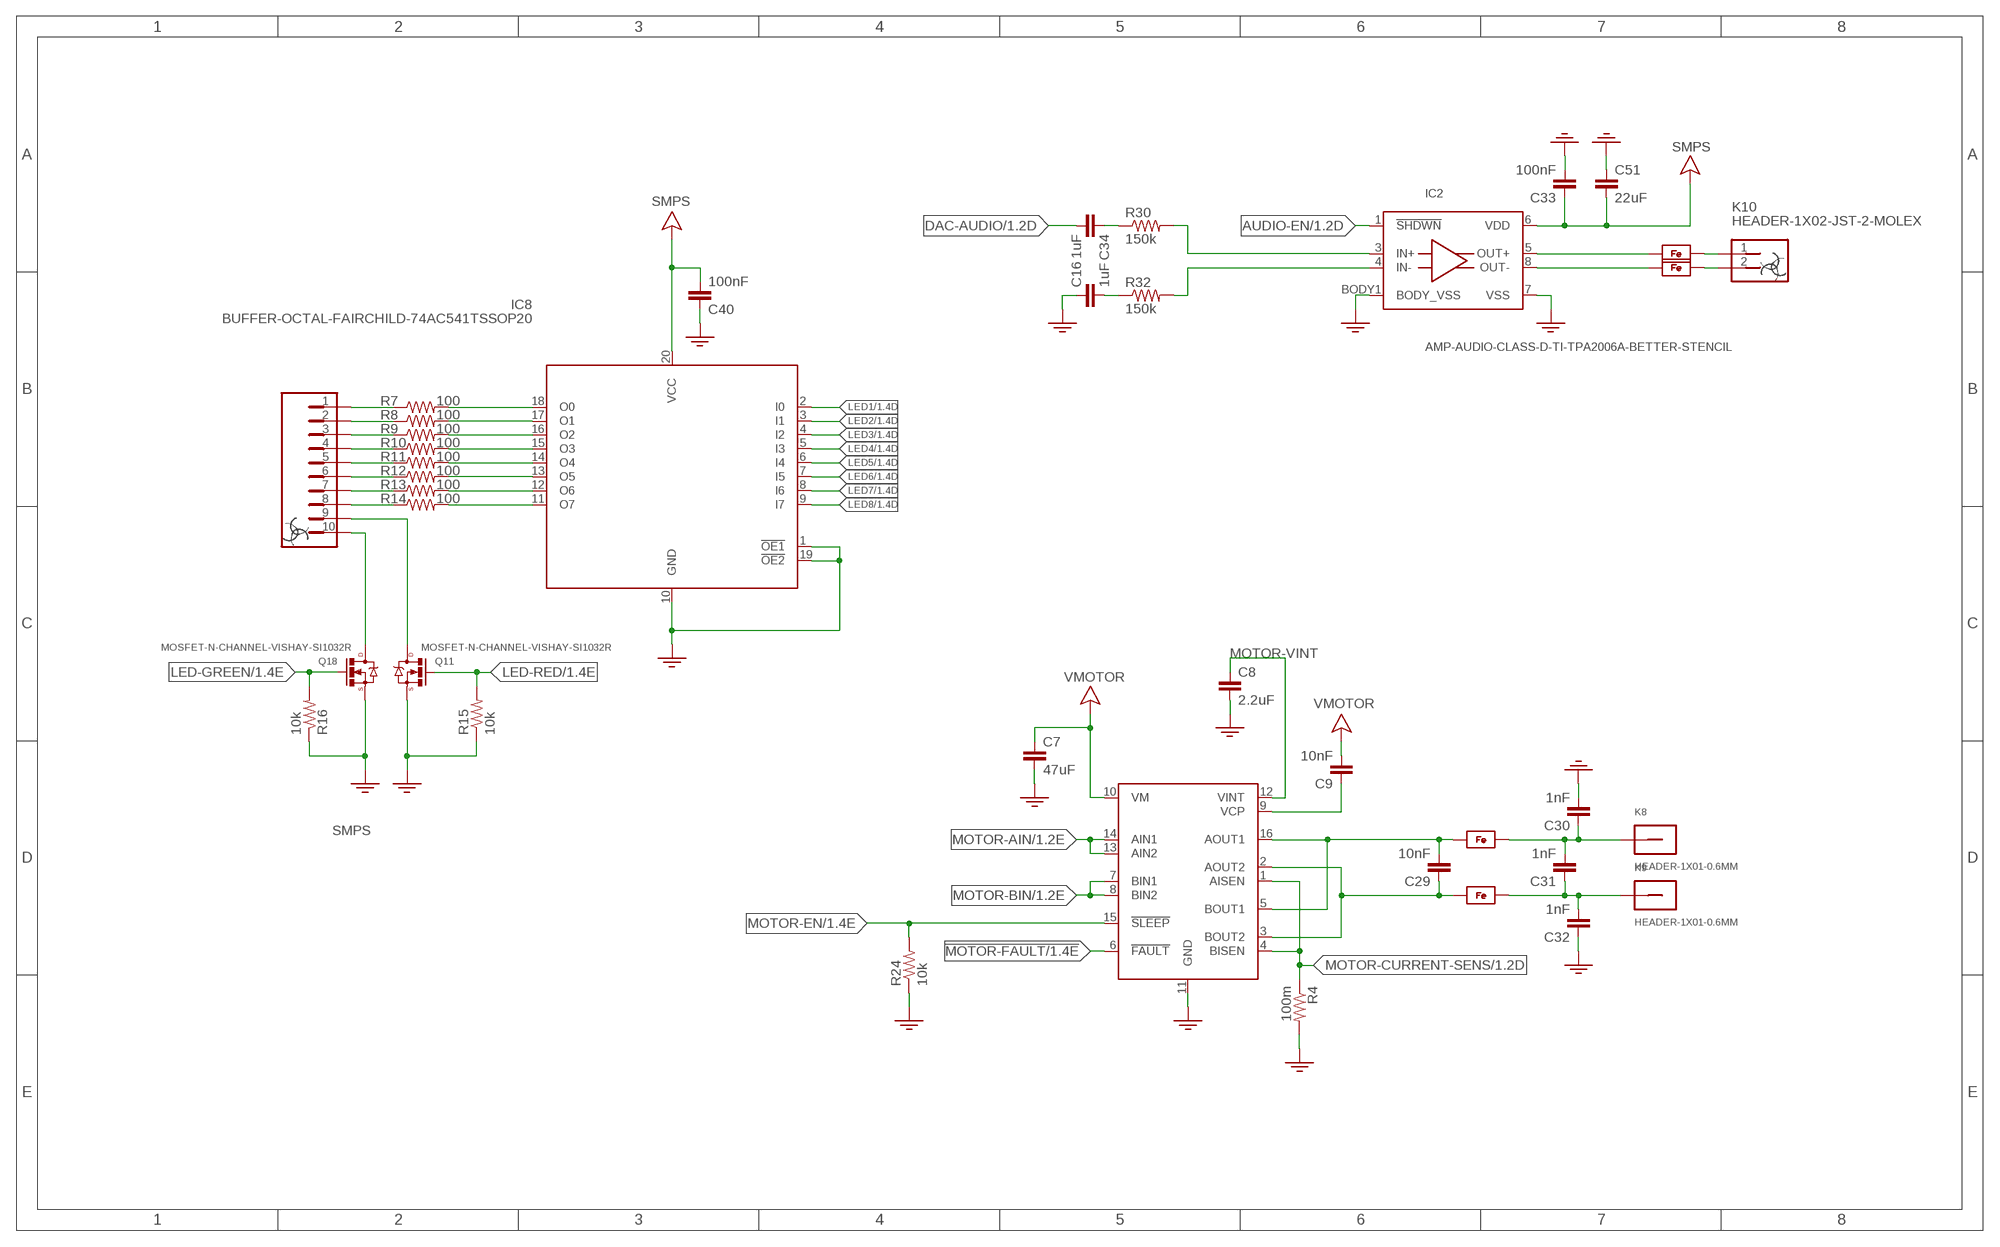
[diagram p3: schematic, sheet 3]

### Parts
C7  47uF  CAP-1206-MIN  [1206-MIN]
C8  2.2uF  CAP-0603-MIN  [0603-MIN]
C9  10nF  CAP-0402  [0402]
C16  1uF  CAP-0402  [0402]
C29  10nF  CAP-0402  [0402]
C30  1nF  CAP-0402  [0402]
C31  1nF  CAP-0402  [0402]
C32  1nF  CAP-0402  [0402]
C33  100nF  CAP-0402  [0402]
C34  1uF  CAP-0402  [0402]
C40  100nF  CAP-0402  [0402]
C51  22uF  CAP-0805-MIN  [0805-MIN]
FB1  FERRITE-0805  FERRITE-BEAD-0805  [0805-MIN]
FB2  FERRITE-0805  FERRITE-BEAD-0805  [0805-MIN]
FB3  FERRITE-0603  FERRITE-BEAD-0603-MIN  [0603-MIN]
FB4  FERRITE-0603  FERRITE-BEAD-0603-MIN  [0603-MIN]
IC2  AMP-AUDIO-CLASS-D-TI-TPA2006A-BETTER-STENCIL  [QFN8-3X3MM-TI-TPA200X-BETTER-STENCIL]
IC4  MOTOR-DRIVER-TI-DRV8833  [QFN16-4X4MM-0.65MM]
IC8  BUFFER-OCTAL-FAIRCHILD-74AC541TSSOP20  [TSSOP20]
K3  HEADER-1X10-NO-SILK-1.27MM  [HEADER-1X10-1.27MM]
K8  HEADER-1X01-0.6MM  [HEADER-1X01-0.6MM-DIAM]
K9  HEADER-1X01-0.6MM  [HEADER-1X01-0.6MM-DIAM]
K10  HEADER-1X02-JST-2-MOLEX  [HEADER-JST-2-MOLEX-53261-0271]
Q11  MOSFET-N-CHANNEL-VISHAY-SI1032R  [SC-75A]
Q18  MOSFET-N-CHANNEL-VISHAY-SI1032R  [SC-75A]
R4  100m  RESISTOR-0603  [0603]
R7  100  RESISTOR-0402-MIN  [0402-MIN]
R8  100  RESISTOR-0402-MIN  [0402-MIN]
R9  100  RESISTOR-0402-MIN  [0402-MIN]
R10  100  RESISTOR-0402-MIN  [0402-MIN]
R11  100  RESISTOR-0402-MIN  [0402-MIN]
R12  100  RESISTOR-0402-MIN  [0402-MIN]
R13  100  RESISTOR-0402-MIN  [0402-MIN]
R14  100  RESISTOR-0402-MIN  [0402-MIN]
R15  10k  RESISTOR-0402-MIN  [0402-MIN]
R16  10k  RESISTOR-0402-MIN  [0402-MIN]
R24  10k  RESISTOR-0402  [0402]
R30  150k  RESISTOR-0402  [0402]
R32  150k  RESISTOR-0402  [0402]

### Nets
!MOTOR-FAULT: IC4.6(!FAULT) ; also sheet 1
AUDIO-EN: IC2.1(!SHDWN) ; also sheet 1
DAC-AUDIO: C34.1 ; also sheet 1
GND: C7.1 C8.1 C16.2 C30.1 C32.2 C33.1 C40.2 C51.2 IC2.7(VSS) IC2.BODY1(BODY_VSS) IC4.11(GND) IC8.1(!OE1) IC8.10(GND) IC8.19(!OE2) Q11.2(SOURCE) Q18.2(SOURCE) R4.2 R15.1 R16.1 R24.1 ; also sheet 1,2
LED1: IC8.2(I0) ; also sheet 1
LED2: IC8.3(I1) ; also sheet 1
LED3: IC8.4(I2) ; also sheet 1
LED4: IC8.5(I3) ; also sheet 1
LED5: IC8.6(I4) ; also sheet 1
LED6: IC8.7(I5) ; also sheet 1
LED7: IC8.8(I6) ; also sheet 1
LED8: IC8.9(I7) ; also sheet 1
LED-GREEN: Q18.1(GATE) R16.2 ; also sheet 1
LED-RED: Q11.1(GATE) R15.2 ; also sheet 1
MOTOR-AIN: IC4.13(AIN2) IC4.14(AIN1) ; also sheet 1
MOTOR-BIN: IC4.7(BIN1) IC4.8(BIN2) ; also sheet 1
MOTOR-CURRENT-SENS: IC4.1(AISEN) IC4.4(BISEN) R4.1 ; also sheet 1
MOTOR-EN: IC4.15(!SLEEP) R24.2 ; also sheet 1
MOTOR-OUT1: C29.1 FB1.1 IC4.5(BOUT1) IC4.16(AOUT1)
MOTOR-OUT2: C29.2 FB2.1 IC4.2(AOUT2) IC4.3(BOUT2)
MOTOR-VCP: C9.2 IC4.9(VCP)
MOTOR-VINT: C8.2 IC4.12(VINT)
N$6: FB4.2 K10.2
N$7: C30.2 C31.1 FB1.2 K8.P$1
N$10: IC8.18(O0) R7.2
N$12: C31.2 C32.1 FB2.2 K9.P$1
N$13: IC8.15(O3) R10.2
N$15: FB3.2 K10.1
N$16: IC8.17(O1) R8.2
N$17: FB3.1 IC2.5(OUT+)
N$18: FB4.1 IC2.8(OUT-)
N$22: IC2.3(IN+) R30.2
N$23: IC2.4(IN-) R32.2
N$25: IC8.13(O5) R12.2
N$26: K3.10 Q18.3(DRAIN)
N$27: C34.2 R30.1
N$28: C16.1 R32.1
N$29: K3.9 Q11.3(DRAIN)
N$30: K3.1 R7.1
N$31: K3.2 R8.1
N$32: K3.3 R9.1
N$33: K3.4 R10.1
N$34: K3.5 R11.1
N$35: K3.6 R12.1
N$36: K3.7 R13.1
N$37: K3.8 R14.1
N$38: IC8.16(O2) R9.2
N$40: IC8.14(O4) R11.2
N$42: IC8.12(O6) R13.2
N$43: IC8.11(O7) R14.2
SMPS: C33.2 C40.1 C51.1 IC2.6(VDD) IC8.20(VCC) ; supply symbol labelled V ; also sheet 1,2
VMOTOR: C7.2 C9.1 IC4.10(VM) ; supply symbol labelled V ; also sheet 2

## Library data of the parts
ANT1 = Outbreak:ANTENNA-WITH-GND
C1-C55 = Outbreak:CAP
D1 = Outbreak:DIODE-TVS
FB1-FB4 = Outbreak:FERRITE-BEAD
IC1 = Outbreak:ST-STM32L15X-48PIN
IC2 = Outbreak:AMP-AUDIO-CLASS-D-TI-TPA2006A
IC3 = Outbreak:BLUETOOTH-4.0-SOC-NORDIC-NRF51822-QFN48
IC4 = Outbreak:MOTOR-DRIVER-TI-DRV8833
IC5 = Outbreak:FLASH-SPI-DUAL-QUAD
IC6 = Outbreak:LDO-REGULATOR-FIXED-WITH-ENABLE: Low Drop-Out (LDO) Volt Regulator with enable pin (active at logic high.)
IC7 = Outbreak:APPLE-MFI-2.0C
IC8 = Outbreak:BUFFER-OCTAL-FAIRCHILD-74AC541
IC9 = Outbreak:SWITCHING-REGULATOR-VARIABLE-BUCK-TI-TPS62056
IC10 = Outbreak:QUAD-ANALOG-SWITCH-4066-MM74HC4066-TSSOP
IC11 = Outbreak:SPDT-SKY13370
IC12 = Outbreak:MURATA-1BD
IC13 = Outbreak:MAGNETOMETER-FREESCALE-MAG3110
K1 = Outbreak:HEADER-1X06-NO-SILK
K2 = Outbreak:HEADER-1X03-NO-SILK
K3 = Outbreak:HEADER-1X10-NO-SILK
K6 K7 K10 = Outbreak:HEADER-1X02
K8 K9 = Outbreak:HEADER-1X01
K11-K13 = Outbreak:HEADER-ARM-JTAG-2X5
L1-L7 = Outbreak:INDUCTOR
Q1-Q5 Q11 Q12 Q18 = Outbreak:MOSFET-N-CHANNEL
Q6-Q10 = Outbreak:MOSFET-P-CHANNEL
R1-R37 = Outbreak:RESISTOR: Resistor Basic schematic elements and footprints for 0603, 1206, and PTH resistors.
TP1-TP6 = Outbreak:TEST-POINT
X1 X3 = Outbreak:CRYSTAL
X2 = Outbreak:CRYSTAL-4-PIN